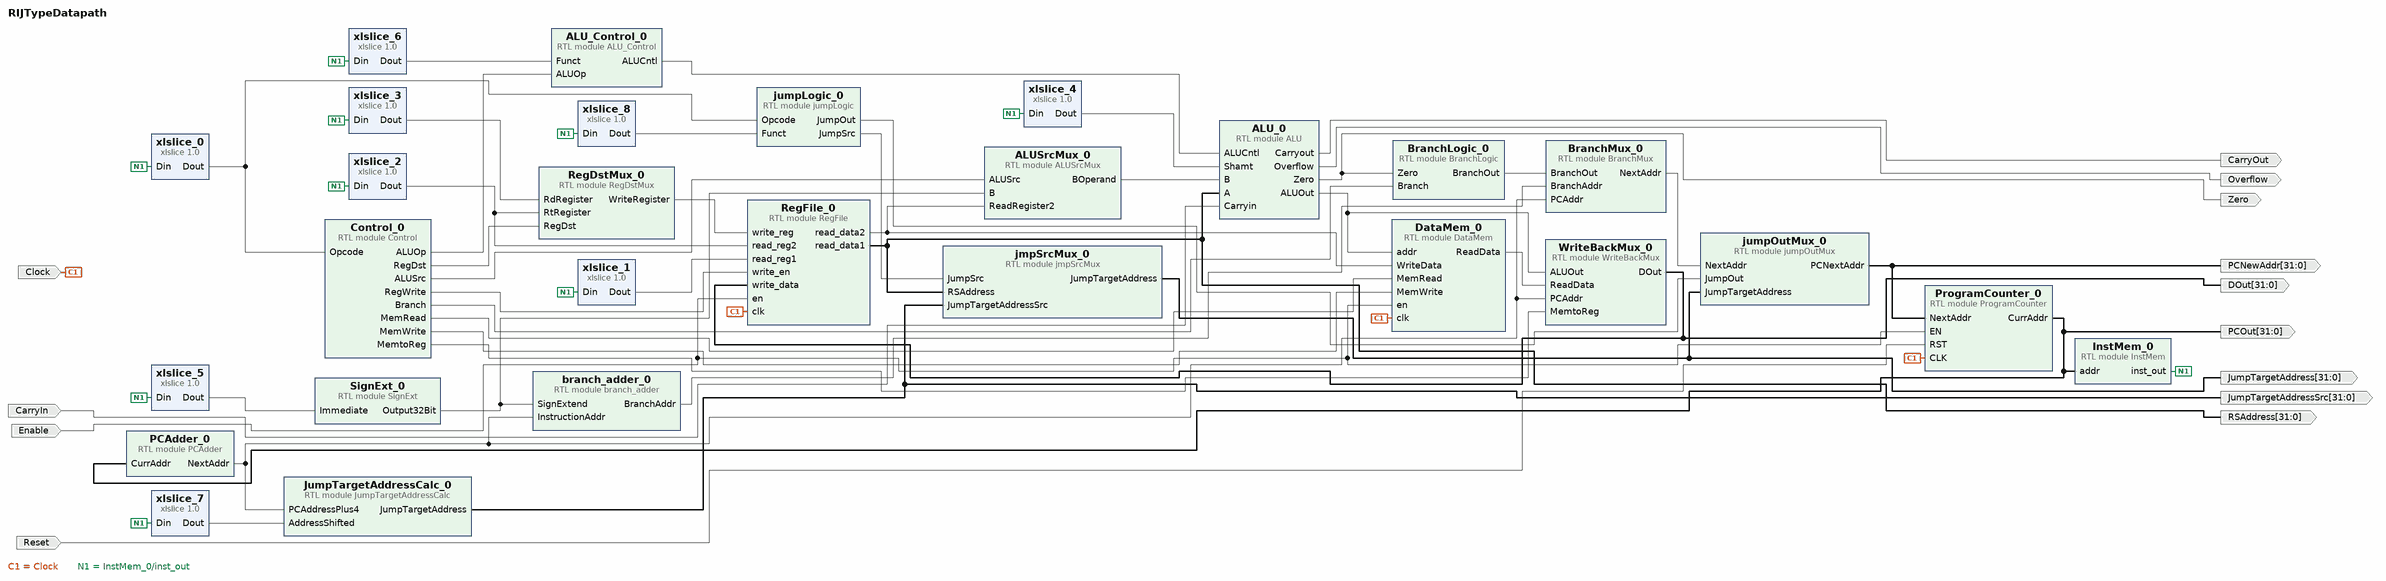
[diagram p0: block diagram of the top level]
# Vivado block design RIJTypeDatapath, xc7a35tcpg236-1, Vivado 2023.2
create_bd_design RIJTypeDatapath

create_bd_port -dir I -type data Clock
create_bd_port -dir I -type data Reset
create_bd_port -dir I -type data Enable
create_bd_port -dir I -type data CarryIn
create_bd_port -dir O -type data Zero
create_bd_port -dir O -type data Overflow
create_bd_port -dir O -type data CarryOut
create_bd_port -dir O -from 31 -to 0 -type data DOut
create_bd_port -dir O -from 31 -to 0 -type data PCOut
create_bd_port -dir O -from 31 -to 0 -type data PCNewAddr
create_bd_port -dir O -from 31 -to 0 -type data RSAddress
create_bd_port -dir O -from 31 -to 0 -type data JumpTargetAddressSrc
create_bd_port -dir O -from 31 -to 0 -type data JumpTargetAddress

create_bd_cell -type module -reference PCAdder PCAdder_0
create_bd_cell -type module -reference ALU ALU_0
create_bd_cell -type module -reference ALUSrcMux ALUSrcMux_0
create_bd_cell -type module -reference ALU_Control ALU_Control_0
create_bd_cell -type module -reference BranchLogic BranchLogic_0
create_bd_cell -type module -reference BranchMux BranchMux_0
create_bd_cell -type module -reference Control Control_0
create_bd_cell -type module -reference DataMem DataMem_0
create_bd_cell -type module -reference InstMem InstMem_0
create_bd_cell -type module -reference ProgramCounter ProgramCounter_0
create_bd_cell -type module -reference RegDstMux RegDstMux_0
create_bd_cell -type module -reference RegFile RegFile_0
create_bd_cell -type module -reference SignExt SignExt_0
create_bd_cell -type module -reference WriteBackMux WriteBackMux_0
create_bd_cell -type module -reference branch_adder branch_adder_0
create_bd_cell -type ip -vlnv xilinx.com:ip:xlslice:1.0 xlslice_0
set_property -dict {CONFIG.DIN_FROM 31 CONFIG.DIN_TO 26} [get_bd_cells xlslice_0]
create_bd_cell -type ip -vlnv xilinx.com:ip:xlslice:1.0 xlslice_1
set_property -dict {CONFIG.DIN_FROM 25 CONFIG.DIN_TO 21} [get_bd_cells xlslice_1]
create_bd_cell -type ip -vlnv xilinx.com:ip:xlslice:1.0 xlslice_2
set_property -dict {CONFIG.DIN_FROM 20 CONFIG.DIN_TO 16} [get_bd_cells xlslice_2]
create_bd_cell -type ip -vlnv xilinx.com:ip:xlslice:1.0 xlslice_3
set_property -dict {CONFIG.DIN_FROM 15 CONFIG.DIN_TO 11} [get_bd_cells xlslice_3]
create_bd_cell -type ip -vlnv xilinx.com:ip:xlslice:1.0 xlslice_4
set_property -dict {CONFIG.DIN_FROM 10 CONFIG.DIN_TO 6} [get_bd_cells xlslice_4]
create_bd_cell -type ip -vlnv xilinx.com:ip:xlslice:1.0 xlslice_5
set_property -dict {CONFIG.DIN_FROM 15} [get_bd_cells xlslice_5]
create_bd_cell -type ip -vlnv xilinx.com:ip:xlslice:1.0 xlslice_6
set_property -dict {CONFIG.DIN_FROM 5} [get_bd_cells xlslice_6]
create_bd_cell -type module -reference JumpTargetAddressCalc JumpTargetAddressCalc_0
create_bd_cell -type module -reference jumpLogic jumpLogic_0
create_bd_cell -type module -reference jumpOutMux jumpOutMux_0
create_bd_cell -type ip -vlnv xilinx.com:ip:xlslice:1.0 xlslice_7
set_property -dict {CONFIG.DIN_FROM 25} [get_bd_cells xlslice_7]
create_bd_cell -type ip -vlnv xilinx.com:ip:xlslice:1.0 xlslice_8
set_property -dict {CONFIG.DIN_FROM 5} [get_bd_cells xlslice_8]
create_bd_cell -type module -reference jmpSrcMux jmpSrcMux_0

# ---- connections ----

connect_bd_net [get_bd_pins ALUSrcMux_0/BOperand] [get_bd_pins ALU_0/B]
connect_bd_net [get_bd_pins ALU_0/ALUOut] [get_bd_pins WriteBackMux_0/ALUOut] [get_bd_pins DataMem_0/addr]
connect_bd_net [get_bd_pins ALU_0/Carryout] [get_bd_ports CarryOut]
connect_bd_net [get_bd_pins ALU_0/Overflow] [get_bd_ports Overflow]
connect_bd_net [get_bd_pins ALU_0/Zero] [get_bd_pins BranchLogic_0/Zero] [get_bd_ports Zero]
connect_bd_net [get_bd_pins ALU_Control_0/ALUCntl] [get_bd_pins ALU_0/ALUCntl]
connect_bd_net [get_bd_pins BranchLogic_0/BranchOut] [get_bd_pins BranchMux_0/BranchOut]
connect_bd_net [get_bd_pins BranchMux_0/NextAddr] [get_bd_pins jumpOutMux_0/NextAddr]
connect_bd_net [get_bd_ports CarryIn] [get_bd_pins ALU_0/Carryin]
connect_bd_net [get_bd_ports Clock] [get_bd_pins ProgramCounter_0/CLK] [get_bd_pins RegFile_0/clk] [get_bd_pins DataMem_0/clk]
connect_bd_net [get_bd_pins Control_0/ALUOp] [get_bd_pins ALU_Control_0/ALUOp]
connect_bd_net [get_bd_pins Control_0/ALUSrc] [get_bd_pins ALUSrcMux_0/ALUSrc]
connect_bd_net [get_bd_pins Control_0/Branch] [get_bd_pins BranchLogic_0/Branch]
connect_bd_net [get_bd_pins Control_0/MemRead] [get_bd_pins DataMem_0/MemRead]
connect_bd_net [get_bd_pins Control_0/MemWrite] [get_bd_pins DataMem_0/MemWrite]
connect_bd_net [get_bd_pins Control_0/MemtoReg] [get_bd_pins WriteBackMux_0/MemtoReg]
connect_bd_net [get_bd_pins Control_0/RegDst] [get_bd_pins RegDstMux_0/RegDst]
connect_bd_net [get_bd_pins Control_0/RegWrite] [get_bd_pins RegFile_0/write_en]
connect_bd_net [get_bd_pins DataMem_0/ReadData] [get_bd_pins WriteBackMux_0/ReadData]
connect_bd_net [get_bd_ports Enable] [get_bd_pins ProgramCounter_0/EN] [get_bd_pins RegFile_0/en] [get_bd_pins DataMem_0/en]
connect_bd_net [get_bd_pins InstMem_0/inst_out] \
  [get_bd_pins xlslice_0/Din] [get_bd_pins xlslice_1/Din] [get_bd_pins xlslice_2/Din] [get_bd_pins xlslice_3/Din] \
  [get_bd_pins xlslice_4/Din] [get_bd_pins xlslice_5/Din] [get_bd_pins xlslice_6/Din] [get_bd_pins xlslice_7/Din] \
  [get_bd_pins xlslice_8/Din]
connect_bd_net [get_bd_pins JumpTargetAddressCalc_0/JumpTargetAddress] \
  [get_bd_pins jmpSrcMux_0/JumpTargetAddressSrc] [get_bd_ports JumpTargetAddressSrc]
connect_bd_net [get_bd_pins PCAdder_0/NextAddr] \
  [get_bd_pins branch_adder_0/InstructionAddr] [get_bd_pins BranchMux_0/PCAddr] \
  [get_bd_pins JumpTargetAddressCalc_0/PCAddressPlus4] [get_bd_pins WriteBackMux_0/PCAddr]
connect_bd_net [get_bd_pins ProgramCounter_0/CurrAddr] [get_bd_pins PCAdder_0/CurrAddr] [get_bd_ports PCOut] [get_bd_pins InstMem_0/addr]
connect_bd_net [get_bd_pins RegDstMux_0/WriteRegister] [get_bd_pins RegFile_0/write_reg]
connect_bd_net [get_bd_pins RegFile_0/read_data1] [get_bd_pins ALU_0/A] [get_bd_pins jmpSrcMux_0/RSAddress] [get_bd_ports RSAddress]
connect_bd_net [get_bd_pins RegFile_0/read_data2] [get_bd_pins ALUSrcMux_0/ReadRegister2] [get_bd_pins DataMem_0/WriteData]
connect_bd_net [get_bd_ports Reset] [get_bd_pins ProgramCounter_0/RST]
connect_bd_net [get_bd_pins SignExt_0/Output32Bit] [get_bd_pins ALUSrcMux_0/B] [get_bd_pins branch_adder_0/SignExtend]
connect_bd_net [get_bd_pins WriteBackMux_0/DOut] [get_bd_pins RegFile_0/write_data] [get_bd_ports DOut]
connect_bd_net [get_bd_pins branch_adder_0/BranchAddr] [get_bd_pins BranchMux_0/BranchAddr]
connect_bd_net [get_bd_pins jmpSrcMux_0/JumpTargetAddress] [get_bd_pins jumpOutMux_0/JumpTargetAddress] [get_bd_ports JumpTargetAddress]
connect_bd_net [get_bd_pins jumpLogic_0/JumpOut] [get_bd_pins jumpOutMux_0/JumpOut]
connect_bd_net [get_bd_pins jumpLogic_0/JumpSrc] [get_bd_pins jmpSrcMux_0/JumpSrc]
connect_bd_net [get_bd_pins jumpOutMux_0/PCNextAddr] [get_bd_pins ProgramCounter_0/NextAddr] [get_bd_ports PCNewAddr]
connect_bd_net [get_bd_pins xlslice_0/Dout] [get_bd_pins Control_0/Opcode] [get_bd_pins jumpLogic_0/Opcode]
connect_bd_net [get_bd_pins xlslice_1/Dout] [get_bd_pins RegFile_0/read_reg1]
connect_bd_net [get_bd_pins xlslice_2/Dout] [get_bd_pins RegFile_0/read_reg2] [get_bd_pins RegDstMux_0/RtRegister]
connect_bd_net [get_bd_pins xlslice_3/Dout] [get_bd_pins RegDstMux_0/RdRegister]
connect_bd_net [get_bd_pins xlslice_4/Dout] [get_bd_pins ALU_0/Shamt]
connect_bd_net [get_bd_pins xlslice_5/Dout] [get_bd_pins SignExt_0/Immediate]
connect_bd_net [get_bd_pins xlslice_6/Dout] [get_bd_pins ALU_Control_0/Funct]
connect_bd_net [get_bd_pins xlslice_7/Dout] [get_bd_pins JumpTargetAddressCalc_0/AddressShifted]
connect_bd_net [get_bd_pins xlslice_8/Dout] [get_bd_pins jumpLogic_0/Funct]

validate_bd_design
save_bd_design
